# Altium schematic sheet Power.SchDoc
size A4
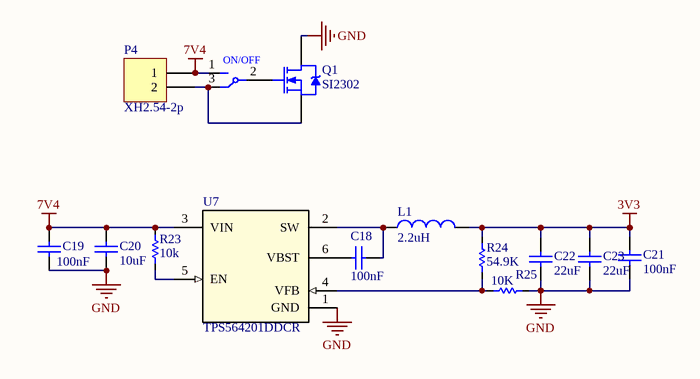
[diagram p0: Power.SchDoc]

## Parts
C18  100nF  [0603C]
C19  100nF  [0603C]
C20  value 10uF  [0805]  (hidden comment: 1uF/0603/50V)
C21  100nF  [0603C]
C22  value 22uF  [0805]  (hidden comment: 1uF/0603/50V)
C23  value 22uF  [0805]  (hidden comment: 1uF/0603/50V)
L1  2.2uH  [4020L]
P4  XH2.54-2p  [XH-2A]
Q1  SI2302  [SOT-23]
R23  10k  [0603R]
R24  54.9K  [0603R]
R25  value 10K  [0603R]  (hidden comment: 1K)
S2  slide switch  [Slide Switch]  (value not drawn)
U7  TPS564201DDCR  [SOT-23thin_L]

## Nets
3V3: C21.2 C22.2 C23.2 L1.2 R24.2
7V4: C19.1 C20.2 P4.1 R23.2 S2.1(NX) U7.3(VIN)
GND: C19.2 C20.1 C21.1 C22.1 C23.1 Q1.3(D) R25.1 U7.1(GND)
NetC18_1: C18.1 U7.6(VBST)
NetC18_2: C18.2 L1.1 U7.2(SW)
NetP4_2: P4.2 Q1.2(S) S2.3(NC)
NetQ1_1: Q1.1(G) S2.2(COM)
NetR23_1: R23.1 U7.5(EN)
NetR24_1: R24.1 R25.2 U7.4(VFB)

## Notes on the sheet
- (in symbol slide switch) ON/OFF

## Library data of the parts
C18 C19 C21 = Cap: Capacitor; Value: 100pF; Published: 8-Jun-2000; LatestRevisionDate: 17-Jul-2002; LatestRevisionNote: Re-released for DXP Platform.; PackageReference: RAD-0.3; Publisher: Altium Limited; PackageDescription: Radial Cap, Thru-Hole; 2 Leads; 0.3 in Pin Spacing
C20 C22 C23 = Cap: Capacitor; Published: 8-Jun-2000; LatestRevisionDate: 17-Jul-2002; LatestRevisionNote: Re-released for DXP Platform.; PackageReference: RAD-0.3; Publisher: Altium Limited; PackageDescription: Radial Cap, Thru-Hole; 2 Leads; 0.3 in Pin Spacing
L1 = Inductor: Code_IEC: 1005; Value: 10mH; Published: 8-Jun-2000; LatestRevisionDate: 29-May-2009; LatestRevisionNote: IPC-7351 Footprint Added.; PackageReference: 0402-A; Publisher: Altium Limited; PackageDescription: Chip Inductor; Code_JEITA: 0402
P4 = Header 2: Header, 2-Pin; LatestRevisionDate: 17-Jul-2002; LatestRevisionNote: Re-released for DXP Platform.; Publisher: Altium Limited
Q1 = NMOS_3p: N-Channel Power MOSFET; Note: Pin 2 is electrically connected to pin 4.; Published: 8-Jun-2000; LatestRevisionDate: 17-Jul-2002; LatestRevisionNote: Re-released for DXP Platform.; DatasheetVersion: PD-9.814; PackageVersion: Feb-1997; PackageReference: TO-220AB; Publisher: Altium Limited; PackageDescription: TO, Thru-Hole, Vertical, Heatsink Mounted; 3 In-Line Leads; Pitch 2.54 mm; ComponentLink1Description: Manufacturer Link; ComponentLink1URL: http://www.irf.com/
R23 R24 = Res1: Resistor; Value: 1K; Published: 8-Jun-2000; LatestRevisionDate: 17-Jul-2002; LatestRevisionNote: Re-released for DXP Platform.; PackageReference: AXIAL-0.3; Publisher: Altium Limited; PackageDescription: Axial Device, Thru-Hole; 2 Leads; 0.3 in Pin Spacing
R25 = Res1: Resistor; Published: 8-Jun-2000; LatestRevisionDate: 17-Jul-2002; LatestRevisionNote: Re-released for DXP Platform.; PackageReference: AXIAL-0.3; Publisher: Altium Limited; PackageDescription: Axial Device, Thru-Hole; 2 Leads; 0.3 in Pin Spacing
U7 = TPS564201DDCR: Imported; Manufacturer: Texas Instruments; PartNumber: TPS564201DDCR; RefDes: RefDes; TYPE: TYPE; Value: Value